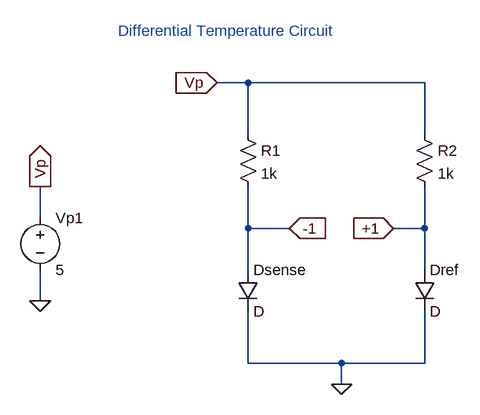
[diagram p0: schematic diff_temp.asc]
diff_temp.asc, the LTspice schematic file:
Version 4
SHEET 1 880 680
WIRE 48 32 0 32
WIRE 320 32 48 32
WIRE 48 112 48 32
WIRE 320 112 320 32
WIRE -272 240 -272 192
WIRE 48 256 48 192
WIRE 112 256 48 256
WIRE 320 256 320 192
WIRE 320 256 272 256
WIRE 48 320 48 256
WIRE 320 320 320 256
WIRE -272 368 -272 320
WIRE 48 464 48 384
WIRE 192 464 48 464
WIRE 320 464 320 384
WIRE 320 464 192 464
WIRE 192 496 192 464
FLAG 192 496 0
FLAG 112 256 -1
IOPIN 112 256 In
FLAG 272 256 +1
IOPIN 272 256 In
FLAG 0 32 Vp
IOPIN 0 32 In
FLAG -272 368 0
FLAG -272 192 Vp
IOPIN -272 192 Out
SYMBOL res 32 96 R0
SYMATTR InstName R1
SYMATTR Value 1k
SYMBOL res 304 96 R0
SYMATTR InstName R2
SYMATTR Value 1k
SYMBOL diode 32 320 R0
SYMATTR InstName Dsense
SYMBOL diode 304 320 R0
SYMATTR InstName Dref
SYMBOL voltage -272 224 R0
SYMATTR InstName Vp1
SYMATTR Value 5
TEXT -152 -48 Left 2 ;Differential Temperature Circuit

The netlist it stands for:
* diff_temp.asc
R1 Vp -1 1k
R2 Vp +1 1k
Dsense -1 0 D
Dref +1 0 D
Vp1 Vp 0 5
.model D D
.lib standard.dio
* Differential Temperature Circuit
.backanno
.end